# Altium schematic sheet PWR_LTM4644.SchDoc
size A3
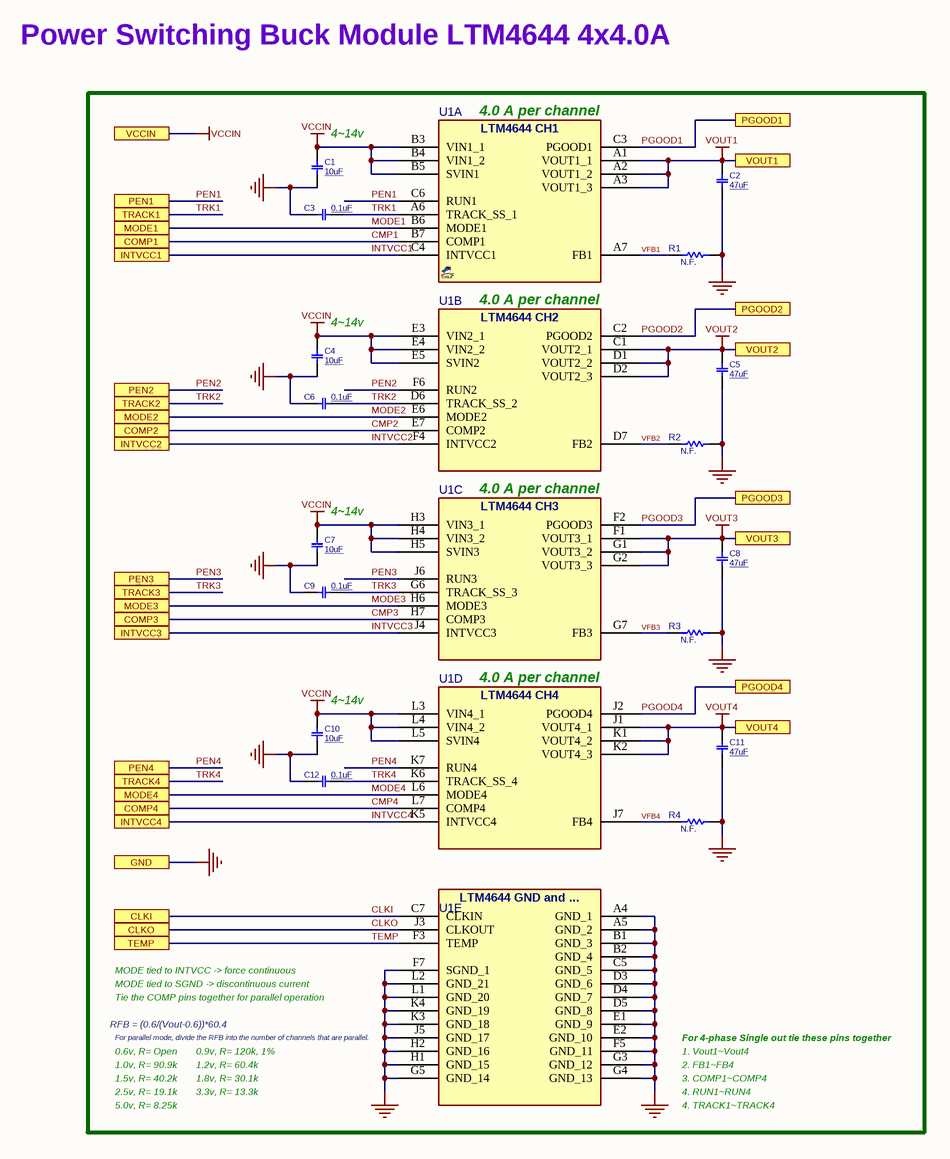
[diagram p0: PWR_LTM4644.SchDoc]

## Parts
C1  10uF  [C0805]
C2  47uF  [C0805]
C3  0.1uF  [C0402]
C4  10uF  [C0805]
C5  47uF  [C0805]
C6  0.1uF  [C0402]
C7  10uF  [C0805]
C8  47uF  [C0805]
C9  0.1uF  [C0402]
C10  10uF  [C0805]
C11  47uF  [C0805]
C12  0.1uF  [C0402]
R1  N.F.  [R0402]
R2  N.F.  [R0402]
R3  N.F.  [R0402]
R4  N.F.  [R0402]
U1  LTM4644  [BGA127_77_1509]  (value not drawn)  (parts A,B,C,D,E of 5)

## Ports
CLKI, CLKO, COMP1, COMP2, COMP3, COMP4, GND, INTVCC1, INTVCC2, INTVCC3, INTVCC4, MODE1, MODE2, MODE3, MODE4, PEN1, PEN2, PEN3, PEN4, PGOOD1, PGOOD2, PGOOD3, PGOOD4, TEMP, TRACK1, TRACK2, TRACK3, TRACK4, VCCIN, VOUT1, VOUT2, VOUT3, VOUT4

## Nets
GND: C1.2 C2.2 C3.1 C4.2 C5.2 C6.1 C7.2 C8.2 C9.1 C10.2 C11.2 C12.1 R1.1 R2.1 R3.1 R4.1 U1.A4(GND_1) U1.A5(GND_2) U1.B1(GND_3) U1.B2(GND_4) U1.C5(GND_5) U1.D3(GND_6) U1.D4(GND_7) U1.D5(GND_8) U1.E1(GND_9) U1.E2(GND_10) U1.F5(GND_11) U1.F7(SGND_1) U1.G3(GND_12) U1.G4(GND_13) U1.G5(GND_14) U1.H1(GND_15) U1.H2(GND_16) U1.J5(GND_17) U1.K3(GND_18) U1.K4(GND_19) U1.L1(GND_20) U1.L2(GND_21) ; port GND
VCCIN: C1.1 C4.1 C7.1 C10.1 U1.B3(VIN1_1) U1.B4(VIN1_2) U1.B5(SVIN1) U1.E3(VIN2_1) U1.E4(VIN2_2) U1.E5(SVIN2) U1.H3(VIN3_1) U1.H4(VIN3_2) U1.H5(SVIN3) U1.L3(VIN4_1) U1.L4(VIN4_2) U1.L5(SVIN4) ; port VCCIN
VOUT1: C2.1 U1.A1(VOUT1_1) U1.A2(VOUT1_2) U1.A3(VOUT1_3) ; port VOUT1
VOUT2: C5.1 U1.C1(VOUT2_1) U1.D1(VOUT2_2) U1.D2(VOUT2_3) ; port VOUT2
VOUT3: C8.1 U1.F1(VOUT3_1) U1.G1(VOUT3_2) U1.G2(VOUT3_3) ; port VOUT3
VOUT4: C11.1 U1.J1(VOUT4_1) U1.K1(VOUT4_2) U1.K2(VOUT4_3) ; port VOUT4
CLKI: U1.C7(CLKIN) ; port CLKI
CLKO: U1.J3(CLKOUT) ; port CLKO
CMP1: U1.B7(COMP1) ; port COMP1
CMP2: U1.E7(COMP2) ; port COMP2
CMP3: U1.H7(COMP3) ; port COMP3
CMP4: U1.L7(COMP4) ; port COMP4
INTVCC1: U1.C4(INTVCC1) ; port INTVCC1
INTVCC2: U1.F4(INTVCC2) ; port INTVCC2
INTVCC3: U1.J4(INTVCC3) ; port INTVCC3
INTVCC4: U1.K5(INTVCC4) ; port INTVCC4
MODE1: U1.B6(MODE1) ; port MODE1
MODE2: U1.E6(MODE2) ; port MODE2
MODE3: U1.H6(MODE3) ; port MODE3
MODE4: U1.L6(MODE4) ; port MODE4
PEN1: U1.C6(RUN1) ; port PEN1
PEN2: U1.F6(RUN2) ; port PEN2
PEN3: U1.J6(RUN3) ; port PEN3
PEN4: U1.K7(RUN4) ; port PEN4
PGOOD1: U1.C3(PGOOD1) ; port PGOOD1
PGOOD2: U1.C2(PGOOD2) ; port PGOOD2
PGOOD3: U1.F2(PGOOD3) ; port PGOOD3
PGOOD4: U1.J2(PGOOD4) ; port PGOOD4
TEMP: U1.F3(TEMP) ; port TEMP
TRK1: C3.2 U1.A6(TRACK_SS_1) ; port TRACK1
TRK2: C6.2 U1.D6(TRACK_SS_2) ; port TRACK2
TRK3: C9.2 U1.G6(TRACK_SS_3) ; port TRACK3
TRK4: C12.2 U1.K6(TRACK_SS_4) ; port TRACK4
VFB1: R1.2 U1.A7(FB1)
VFB2: R2.2 U1.D7(FB2)
VFB3: R3.2 U1.G7(FB3)
VFB4: R4.2 U1.J7(FB4)

## Notes on the sheet
- Power Switching Buck Module LTM4644 4x4.0A
- (near C1) 4~14v
- (near U1) 4.0 A per channel
- (near C4) 4~14v
- (near C7) 4~14v
- (near C10) 4~14v
- MODE tied to INTVCC -> force continuous
- MODE tied to SGND -> discontinuous current
- Tie the COMP pins together for parallel operation
- RFB = (0.6/(Vout-0.6))*60.4
- (near U1) For parallel mode, divide the RFB into the number of channels that are parallel.
- 1.0v, R= 90.9k
- 1.5v, R= 40.2k
- 2.5v, R= 19.1k
- 0.6v, R= Open
- 1.8v, R= 30.1k
- 3.3v, R= 13.3k
- 1.2v, R= 60.4k
- 0.9v, R= 120k, 1%
- For 4-phase Single out tie these pins together
- 1. Vout1~Vout4
- 2. FB1~FB4
- 3. COMP1~COMP4
- 4. RUN1~RUN4
- 5.0v, R= 8.25k
- 4. TRACK1~TRACK4
- (in symbol LTM4644_BGA77, part A) LTM4644 CH1
- (in symbol LTM4644_BGA77, part B) LTM4644 CH2
- (in symbol LTM4644_BGA77, part C) LTM4644 CH3
- (in symbol LTM4644_BGA77, part D) LTM4644 CH4
- (in symbol LTM4644_BGA77, part E) LTM4644 GND and ...

## Library data of the parts
C1 C4 C7 C10 = CAP_SMD_MLCC: CAP, MLCC; PARAM: X5R, 20%; PARAM2: 25v; PRICE: 100= 1$; DESC: CAP, MLCC; MANF_P#: -; MANF: -; ASSEMBLY: ASSEMBLY; VALUE: 10uF
C2 C5 C8 C11 = CAP_SMD_MLCC: CAP, MLCC; PARAM: X5R, 20%; PARAM2: 6.3v; PRICE: 100= 1$; DESC: CAP, MLCC; MANF_P#: -; MANF: -; ASSEMBLY: ASSEMBLY; VALUE: 47uF
C3 C6 C9 C12 = CAP_SMD_MLCC: CAP, MLCC; PARAM2: 50v; PARAM: -; PRICE: 100= 1$; DESC: CAP, MLCC; MANF_P#: -; MANF: -; ASSEMBLY: ASSEMBLY; VALUE: 0.1uF
R1-R4 = RES_SMD: RESISTOR, SMD; PARAM: -W; DESC: DESCRIPTION; DIST#: MOUSER; PARAM2: 1%; MANF_P#: -; MANF: -; ASSEMBLY: ASSEMBLY; PRICE: 100= 0.5$; VALUE: N.F.
U1 = LTM4644_BGA77: DC2DC Switching MODULE, QUAD, 4A; MANF: ANALOG DEVICE; MANF_P#: LTM4644EY, LTM4644IY; PARAM2: 4~14VIN, 0.6~5.5VOUT; PARAM: 4A, –40~125°C; PRICE: -; VALUE: LTM4644